# EAGLE design ultra-violet-tooth-sensor-mk-2.3 (EAGLE 6.5.0)
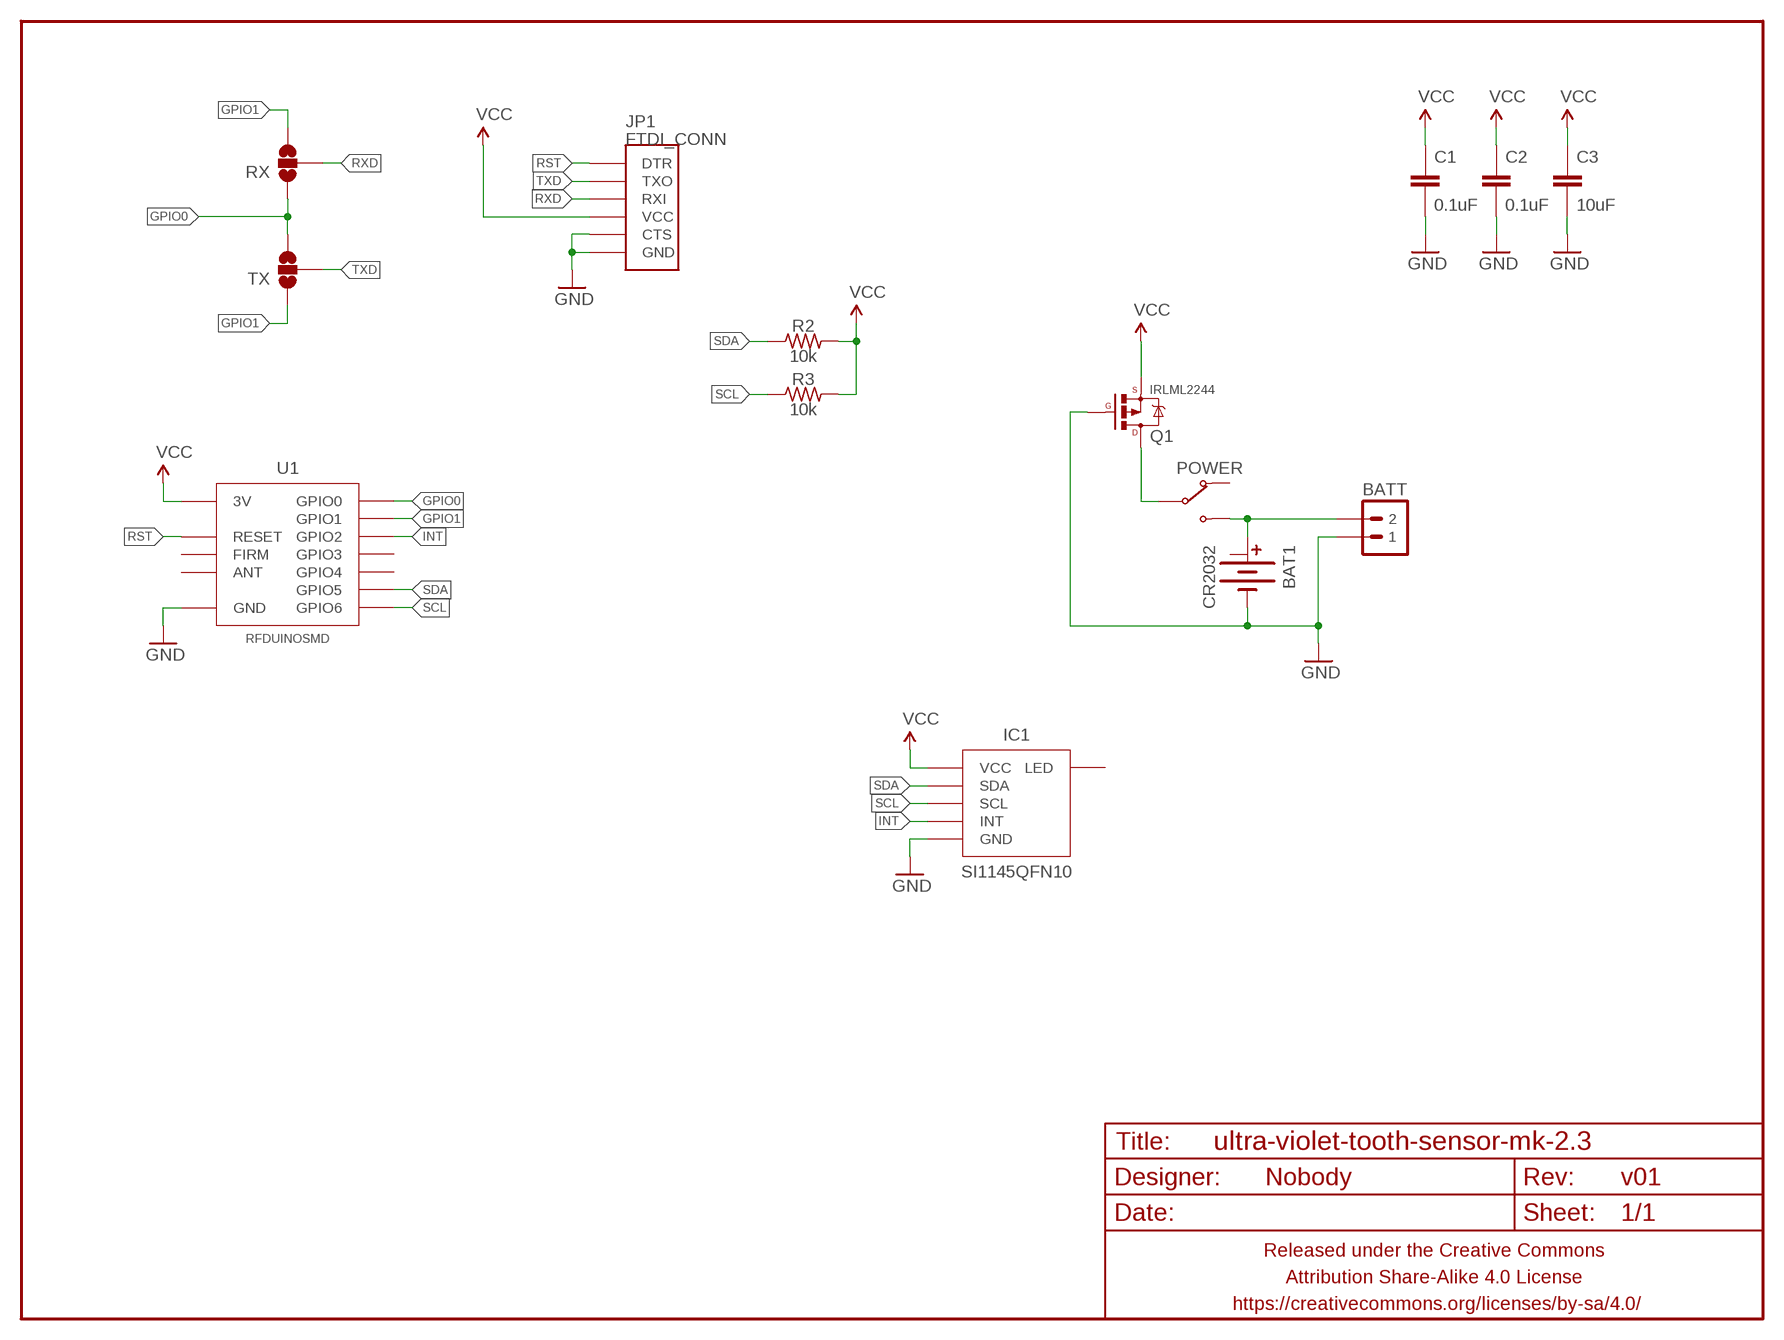
[diagram p0: schematic, sheet 1]

## Parts
BAT1  CR2032  BATTERY-COINCR2032_SMD_TIGHT  [BATTCON_20MM_MINE_STAHPIT]
BATT  M02PTH-CENTERED-R+  [1X02-CENTER-R+]
C1  0.1uF  CAPACITOR-CERAMICC0805  [C0805]
C2  0.1uF  CAPACITOR-CERAMICC0603  [C0603]
C3  10uF  CAPACITOR-CERAMICC1206  [C1206]
FRAME1  FRAME-LETTERNO_PACKAGE  [DUMMY]
IC1  SI1145QFN10  [SI1145]
JP1  FTDI_CONN  [FTDI_CONN]
POWER  SWITCH-SPDTPCM12SMTR  [SWITCH-SPDT-SMD-RA-PCM12SMTR]
Q1  IRLML2244  MOSFET-PCHANNELIRLML2244  [SOT23-3]
R2  10k  RESISTORR0603  [R0603]
R3  10k  RESISTORR0603  [R0603]
RX  JUMPER-PAD-3-NOFULL_BOX_SILK  [PAD-JUMPER-3-NO_YES_SILK_FULL_BOX]
TX  JUMPER-PAD-3-NOFULL_BOX_SILK  [PAD-JUMPER-3-NO_YES_SILK_FULL_BOX]
U1  RFDUINOSMD  [RFDUINO-SMD]

## Nets
GND: BAT1.BOTTOM(-) BATT.1 C1.2 C2.2 C3.2 IC1.GND JP1.CTS JP1.GND Q1.1(G) U1.GND@1(GND) U1.GND@2(GND) U1.GND@3(GND) U1.GND@4(GND) U1.GND@5(GND) U1.GND@6(GND) U1.GND@7(GND) U1.GND@8(GND)
GPIO0: RX.1 TX.3 U1.GPIO0
GPIO1: RX.3 TX.1 U1.GPIO1
INT: IC1.INT U1.GPIO2
N$1: BAT1.TOP@1(+) BATT.2 POWER.3(NO)
N$2: POWER.2(COM) Q1.3(D)
RST: JP1.DTR U1.RESET
RXD: JP1.RXI RX.2
SCL: IC1.SCL R3.1 U1.GPIO6
SDA: IC1.SDA R2.1 U1.GPIO5
TXD: JP1.TXO TX.2
VCC: C1.1 C2.1 C3.1 IC1.VCC@1(VCC) IC1.VCC@2(VCC) IC1.VCC@3(VCC) JP1.VCC Q1.2(S) R2.2 R3.2 U1.3V
Unconnected: BAT1.TOP@2(+1) IC1.LED POWER.1(NC) U1.ANT U1.FACTORY(FIRM) U1.GPIO3 U1.GPIO4

## Library data of the parts
BAT1 = A_butts:BATTERY-COIN
BATT = A_butts:M02: Standard 2-pin 0.1" header. Use with - straight break away headers ( PRT-00116) - right angle break away headers (PRT-00553) - swiss pins (PRT-00743) - machine pins (PRT-00117) - female headers (PRT-00115) Molex polarized connector foot print use with: PRT-08233 with associated crimp pins and housings. 2.54_SCREWTERM for use with PRT-10571. 3.5mm Screw Terminal footprints for PRT-08084 5mm Screw Terminal footprints for use with PRT-08433
C1-C3 = A_butts:CAPACITOR-CERAMIC: CAPACITOR, European symbol
FRAME1 = A_butts:FRAME-LETTER: Schematic Frame Standard 8.5x11 US Letter frame; DESIGNER: Nobody; VERSION: v01
IC1 = A_butts:SI1145
JP1 = A_butts:FTDI_CONN: Connector which mates to FTDI basic or FTDI cable.
POWER = A_butts:SWITCH-SPDT
Q1 = A_butts:MOSFET-PCHANNEL: Generic PMOSFET IRLML2244 - TRANS-11153 (SOT-23 -20V -4.3A) (1.Gate 2.Source 3.Drain) FQP27P06 - COM-10349 <http://www.sparkfun.com/products/10349> (TO-220 -60V -27A) (1.Gate 2.Source 3.Drain); PROD_ID: TRANS-11153
R2 R3 = A_butts:RESISTOR: RESISTOR, American symbol
RX TX = A_butts:JUMPER-PAD-3-NO
U1 = A_butts:RFDUINO

## Board
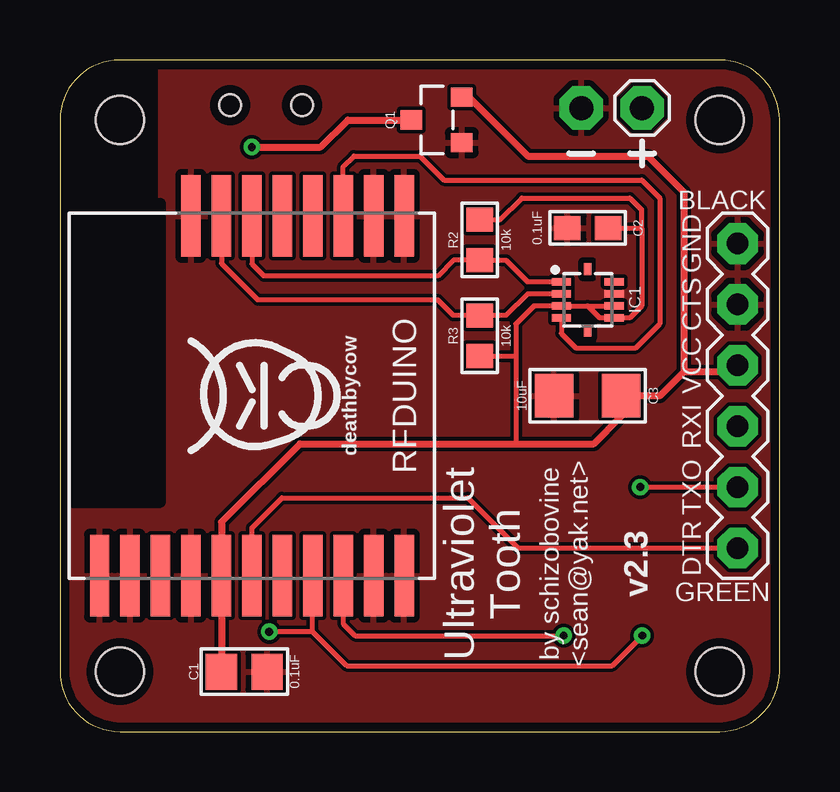
[diagram p1: board, top side]
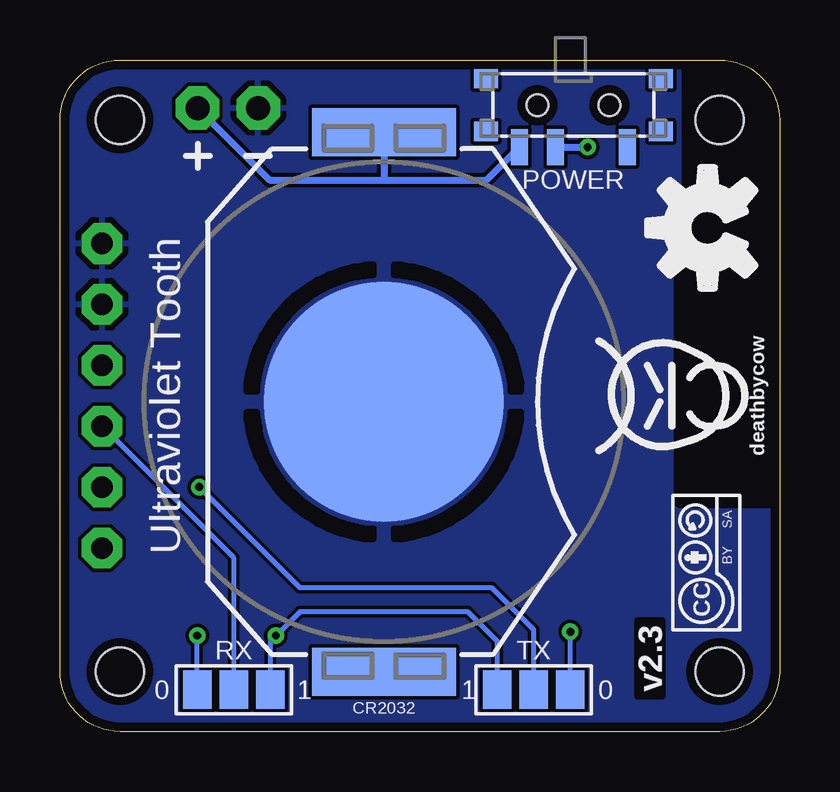
[diagram p2: board, bottom side, seen from below]

Size 30 x 28 mm. Coordinates in mm from the lower left corner, seen from the top.
Outline: 30,2.5 30,25.5 arc90 27.5,28 2.5,28 arc90 0,25.5 0,2.5 arc90 2.5,0 27.5,0 arc90 30,2.5
Copper layers (1*16): Top 0.0356mm / dielectric 1.5011mm / Bottom 0.0356mm
Design rules "LaenPCBOrder_2": minimum track width 6mil, minimum drill 13mil, track to track 6mil, track to pad 6mil, pad to pad 6mil, via to via 6mil, smd to smd 6mil, copper to edge 15mil, drill to drill 6mil, minimum pad ring 7mil, minimum via ring 7mil, stop-mask expansion 3mil, vias tented up to drill 20mil, thermal gap 10mil
Holes 2 mm at 2.5,25.5 2.5,2.5 27.5,25.5 27.5,2.5

### Footprints (pad centres in the part's own frame; a part is rotated, then mirrored left to right if it is on the bottom)
BATTCON_20MM_MINE_STAHPIT = smd 10 x 10: BOTTOM 0,0 | smd 6 x 2: TOP@1 0,11.25; TOP@2 0,-11.25
1X02-CENTER-R+ = drill 1 pad 1.8 octagon: 1 -1.27,0; 2 1.27,0
C0805 = smd 1.3 x 1.5: 1 -0.95,0; 2 0.95,0
C0603 = smd 1.1 x 1: 1 -0.85,0; 2 0.85,0
C1206 = smd 1.6 x 1.8: 1 -1.4,0; 2 1.4,0
SI1145 = smd 0.8 x 0.3: GND 1.1,0.25; INT -1.1,-0.75; LED 1.1,0.75; SCL -1.1,0.25; SDA -1.1,0.75; VCC@1 -1.1,-0.25; VCC@2 1.1,-0.25; VCC@3 1.1,-0.75 | smd 0.3 x 0.5: NC@1 0,1.275; NC@2 0,-1.275
FTDI_CONN = drill 0.9 pad 1.7 octagon: CTS 3.81,0; DTR -6.35,0; GND 6.35,0; RXI -1.27,0; TXO -3.81,0; VCC 1.27,0
SWITCH-SPDT-SMD-RA-PCM12SMTR = smd 0.7 x 1.5: 1 -2.25,1.75; 2 0.75,1.75; 3 2.25,1.75 | smd 1 x 0.8: NC@1 -3.65,1.1; NC@2 -3.65,-1.1; NC@3 3.65,1.1; NC@4 3.65,-1.1 | hole 0.9: -1.5,0; 1.5,0
SOT23-3 = smd 0.8 x 0.9: 1 -0.95,-1; 2 0.95,-1; 3 0,1.1
R0603 = smd 1 x 1.1: 1 -0.85,0; 2 0.85,0
PAD-JUMPER-3-NO_YES_SILK_FULL_BOX = smd 1.2 x 1.6: 1 -1.524,0; 2 0,0; 3 1.524,0
RFDUINO-SMD = smd 3.4 x 0.8: 3V 7.5,-1.27; ANT 7.5,-3.81; FACTORY 7.5,1.27; GND@1 -7.5,6.35; GND@2 -7.5,5.08; GND@3 -7.5,-2.54; GND@4 7.5,-6.35; GND@5 7.5,-5.08; GND@6 7.5,-2.54; GND@7 7.5,5.08; GND@8 7.5,6.35; GPIO0 7.5,2.54; GPIO1 7.5,3.81; GPIO2 -7.5,3.81; GPIO3 -7.5,2.54; GPIO4 -7.5,1.27; GPIO5 -7.5,0; GPIO6 -7.5,-1.27; RESET 7.5,0

### Placement (x,y rotation side)
BAT1  16.5,13.75 0 bottom
BATT  23,26 0 top
C1  7.68,2.5 0 top
C2  22,21 180 top
C3  22,14 180 top
FRAME1  0,0 180 top
IC1  22,18 0 top
JP1  28.25,14 90 top
POWER  8.6,26.12 180 bottom
Q1  15.75,25.5 90 top
R2  17.5,20.5 90 top
R3  17.5,16.5 270 top
RX  22.75,1.75 0 bottom
TX  10.25,1.75 0 bottom
U1  8,14 270 top
U$1  [CC-BY-SA-4.0-NO-URL]  3.05,7.05 90 bottom
U$2  [COW_SMALL]  5,14 90 bottom
U$5  [COW_SMALL]  8,14 90 top
U$6  [OSHWLOGO_SILKONLY]  3,21 90 bottom

### Tracks (layer width: path | path; a pad name or v marks a point on that pad's centre or on a via)
GND
  pour Top (isolate 0.152, rank 6): 30.1,28.1 30.1,-0.1 -0.1,-0.1 -0.1,9.5 4.15,9.5 4.15,28.1
  pour Bottom (isolate 0.152, rank 6): 30.1,28.1 30.1,-0.1 -0.1,-0.1 -0.1,9.5 4.15,9.5 4.15,28.1
  pour Top: 22.4,17.75 22.4,20 23.75,20 23.75,17.75
GPIO0  (via drill 0.33)
  Top 0.2: 10.54,4.16 11.95,2.75 23.02,2.75 v24.27,4 | 10.54,4.16 U1.GPIO0 | 10.54,4.16 v8.73,4.16
  Bottom 0.2: RX.1 v24.27,4 | TX.3 v8.73,4.16
GPIO1  (via drill 0.33)
  Top 0.2: U1.GPIO1 11.81,4.5 12.31,4 v21,4
  Bottom 0.2: TX.1 11.77,3.77 13,5 20,5 v21,4 21.23,3.77 RX.3
INT
  Top 0.2: U1.GPIO2 11.81,23.56 12.25,24 15,24 16,23 24.25,23 25,22.25 25,17 24,16 21.5,16 20.9,16.6 IC1.INT
N$1
  Bottom 0.3: POWER.3 12.22,23 16.5,23 | BATT.2 21.27,23 16.5,23 | BAT1.TOP@1 16.5,23
N$2  (via drill 0.33)
  Top 0.3: v8,24.37 10.87,24.37 12,25.5 Q1.3
  Bottom 0.3: POWER.2 v8,24.37
RST
  Top 0.2: U1.RESET 8,8.5 9.25,9.75 17,9.75 19.1,7.65 JP1.DTR
RXD
  Bottom 0.2: RX.2 22.75,7.23 JP1.RXI
SCL
  Top 0.2: U1.GPIO6 6.73,19.52 8.25,18 15.75,18 16.4,17.35 R3.1 18.6,17.35 19.5,18.25 IC1.SCL
SDA
  Top 0.2: U1.GPIO5 8,19.5 8.5,19 15.75,19 16.4,19.65 R2.1 18.6,19.65 19.5,18.75 IC1.SDA
TXD  (via drill 0.33)
  Top 0.2: v24.19,10.19 JP1.TXO
  Bottom 0.2: TX.2 10.25,4.25 12,6 20,6 v24.19,10.19
VCC
  Top 0.2: 19,15.65 19,17 19.75,17.75 IC1.VCC@1 22,17.75 | 19,15.65 19,12 | R3.2 19,15.65 | 22,17.75 IC1.VCC@2 | 22,17.75 22.5,17.25 IC1.VCC@3 23.75,17.25 24.25,17.75 24.25,21 | C2.1 24.25,21 | R2.2 18.35,21.35 19.25,22.25 23.75,22.25 24.25,21.75 24.25,21
  Top 0.3: C1.1 U1.3V 6.73,8.73 10,12 19,12 22.25,12 23.4,13.15 C3.1 25,14 26,15 | Q1.2 17.05,26.45 19.5,24 24.5,24 26,22.5 26,15 | JP1.VCC 27.98,15 26,15

### Text on the board
tPlace: Ultraviolet / Tooth | by schizobovine / <sean@yak.net>
bPlace: Ultraviolet Tooth | 0 | 1 | 1 | 0